# Altium schematic sheet DVM1.SchDoc
size A4; SheetNumber: 1; SheetTotal: 1
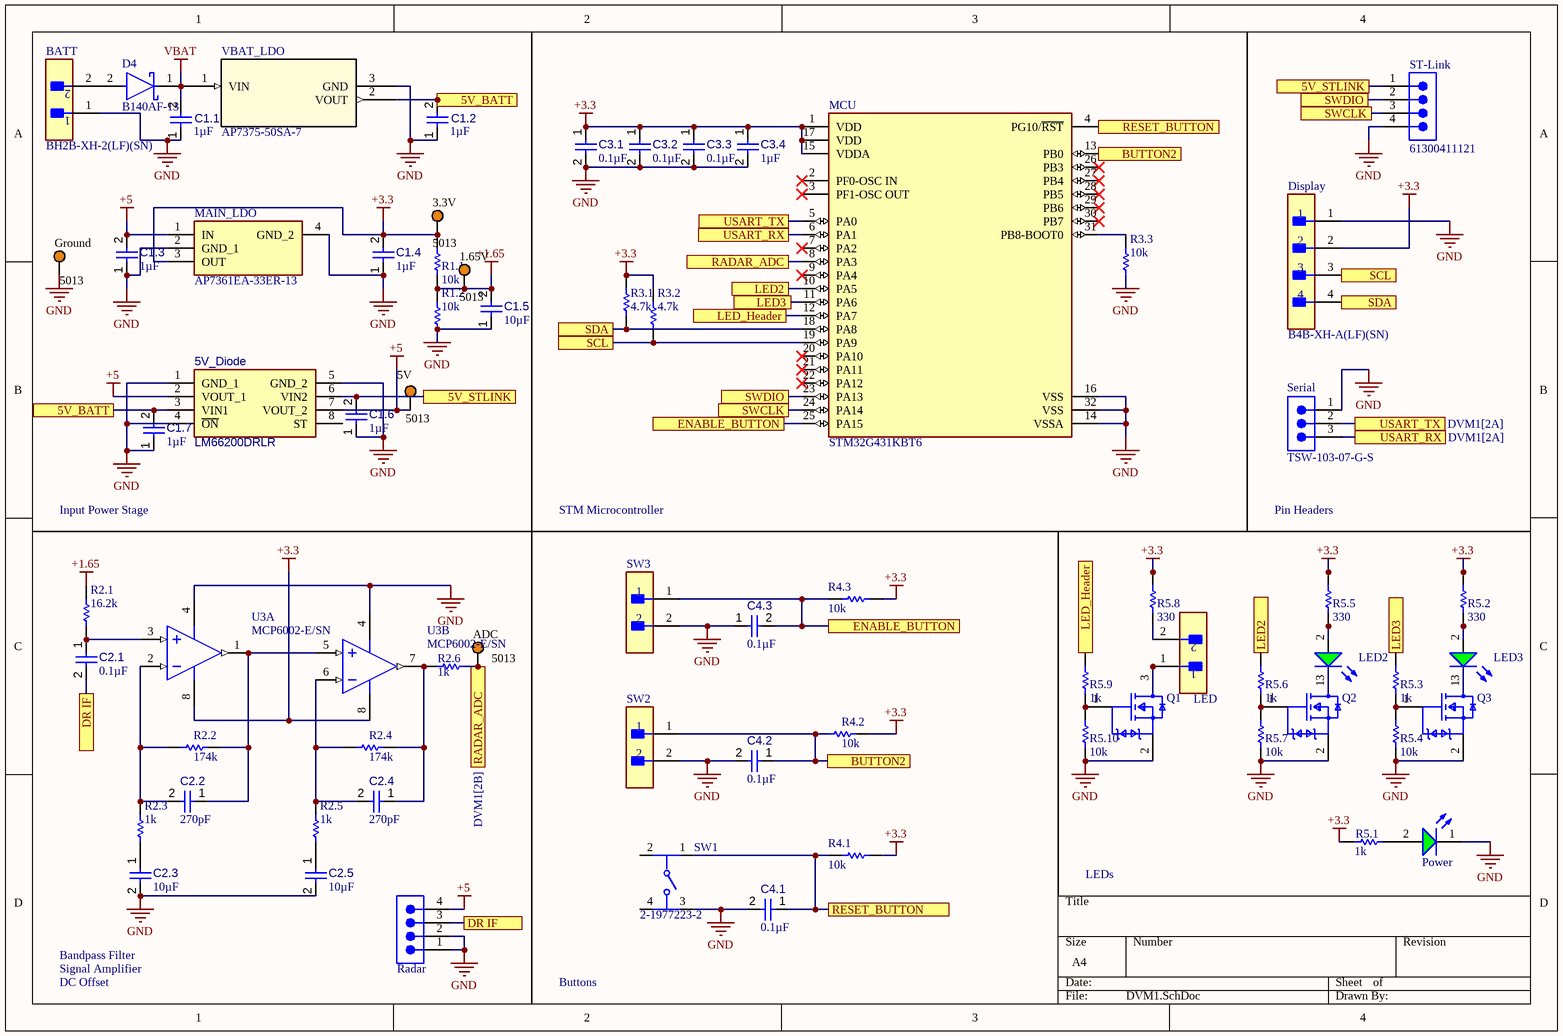
[diagram p0: DVM1.SchDoc]

## Parts
1.65V  5013  [KSTN-5013_V]
3.3V  5013  [KSTN-5013_V]
5V  5013  [KSTN-5013_V]
5V_Diode  LM66200DRLR  [LM66200DRLR-Footprint-1]
ADC  5013  [KSTN-5013_V]
BATT  BH2B-XH-2(LF)(SN)  [FP-BH2B-XH-2_LF_SN-MFG]
C1.1  value 1µF  [CAPC2013X145X50ML20T25]  (hidden comment: CAP-NP-2)
C1.2  value 1µF  [CAPC2013X145X50ML20T25]  (hidden comment: CAP-NP-2)
C1.3  value 1µF  [CAPC2013X145X50ML20T25]  (hidden comment: CAP-NP-2)
C1.4  value 1µF  [CAPC2013X145X50ML20T25]  (hidden comment: CAP-NP-2)
C1.5  value 10µF  [CAPC2013X145X50ML20T25]  (hidden comment: CAP-NP-2)
C1.6  value 1µF  [CAPC2013X145X50ML20T25]  (hidden comment: CAP-NP-2)
C1.7  value 1µF  [CAPC2013X145X50ML20T25]  (hidden comment: CAP-NP-2)
C2.1  value 0.1µF  [CAPC2013X145X50ML20T25]  (hidden comment: CAP-NP-2)
C2.2  value 270pF  [CAPC2013X145X50ML20T25]  (hidden comment: CAP-NP-2)
C2.3  value 10µF  [CAPC2013X145X50ML20T25]  (hidden comment: CAP-NP-2)
C2.4  value 270pF  [CAPC2013X145X50ML20T25]  (hidden comment: CAP-NP-2)
C2.5  value 10µF  [CAPC2013X145X50ML20T25]  (hidden comment: CAP-NP-2)
C3.1  value 0.1µF  [CAPC2013X145X50ML20T25]  (hidden comment: CAP-NP-2)
C3.2  value 0.1µF  [CAPC2013X145X50ML20T25]  (hidden comment: CAP-NP-2)
C3.3  value 0.1µF  [CAPC2013X145X50ML20T25]  (hidden comment: CAP-NP-2)
C3.4  value 1µF  [CAPC2013X145X50ML20T25]  (hidden comment: CAP-NP-2)
C4.1  value 0.1µF  [CAPC2013X145X50ML20T25]  (hidden comment: CAP-NP-2)
C4.2  value 0.1µF  [CAPC2013X145X50ML20T25]  (hidden comment: CAP-NP-2)
C4.3  value 0.1µF  [CAPC2013X145X50ML20T25]  (hidden comment: CAP-NP-2)
D4  B140AF-13  [FP-SMAF-MFG]
Display  B4B-XH-A(LF)(SN)  [FP-B4B-XH-A_LF_SN-MFG]
Ground  5013  [KSTN-5013_V]
LED  TSW-102-14-G-S  [FP-TSW-102-14-G-S-MFG]  (value not drawn)
LED2  150060VS75000  [WL-SMCW_0603_150060xx75000]  (value not drawn)
LED3  150060VS75000  [WL-SMCW_0603_150060xx75000]  (value not drawn)
MAIN_LDO  AP7361EA-33ER-13  [AP7361EA-33ER-13-Footprint-1]
MCU  STM32G431KBT6  [FP-LQFP32-5V-IPC_B]
Power  150060VS75000  [WL-SMCW_0603_150060xx75000]  (value not drawn)
Q1  DMN3023L-7  [FP-SOT23-MFG]  (value not drawn)
Q2  DMN3023L-7  [FP-SOT23-MFG]  (value not drawn)
Q3  DMN3023L-7  [FP-SOT23-MFG]  (value not drawn)
R1.1  value 10k  [RESC2013X70X40ML20T20]  (hidden comment: RES-2)
R1.2  value 10k  [RESC2013X70X40ML20T20]  (hidden comment: RES-2)
R2.1  value 16.2k  [RESC2013X70X40ML20T20]  (hidden comment: RES-2)
R2.2  value 174k  [RESC2013X70X40ML20T20]  (hidden comment: RES-2)
R2.3  value 1k  [RESC2013X70X40ML20T20]  (hidden comment: RES-2)
R2.4  value 174k  [RESC2013X70X40ML20T20]  (hidden comment: RES-2)
R2.5  value 1k  [RESC2013X70X40ML20T20]  (hidden comment: RES-2)
R2.6  value 1k  [RESC2013X70X40ML20T20]  (hidden comment: RES-2)
R3.1  value 4.7k  [RESC2013X70X40ML20T20]  (hidden comment: RES-2)
R3.2  value 4.7k  [RESC2013X70X40ML20T20]  (hidden comment: RES-2)
R3.3  value 10k  [RESC2013X70X40ML20T20]  (hidden comment: RES-2)
R4.1  value 10k  [RESC2013X70X40ML20T20]  (hidden comment: RES-2)
R4.2  value 10k  [RESC2013X70X40ML20T20]  (hidden comment: RES-2)
R4.3  value 10k  [RESC2013X70X40ML20T20]  (hidden comment: RES-2)
R5.1  value 1k  [RESC2013X70X40ML20T20]  (hidden comment: RES-2)
R5.2  value 330  [RESC2013X70X40ML20T20]  (hidden comment: RES-2)
R5.3  value 1k  [RESC2013X70X40ML20T20]  (hidden comment: RES-2)
R5.4  value 10k  [RESC2013X70X40ML20T20]  (hidden comment: RES-2)
R5.5  value 330  [RESC2013X70X40ML20T20]  (hidden comment: RES-2)
R5.6  value 1k  [RESC2013X70X40ML20T20]  (hidden comment: RES-2)
R5.7  value 10k  [RESC2013X70X40ML20T20]  (hidden comment: RES-2)
R5.8  value 330  [RESC2013X70X40ML20T20]  (hidden comment: RES-2)
R5.9  value 1k  [RESC2013X70X40ML20T20]  (hidden comment: RES-2)
R5.10  value 10k  [RESC2013X70X40ML20T20]  (hidden comment: RES-2)
Radar  61300411121  [61300411121]  (value not drawn)
Serial  TSW-103-07-G-S  [SMTC-TSW-103-07-X-S]
ST-Link  61300411121  [61300411121]
SW1  2-1977223-2  [FP-2-1977223-2-MFG]
SW2  TSW-102-14-G-S  [FP-TSW-102-14-G-S-MFG]  (value not drawn)
SW3  TSW-102-14-G-S  [FP-TSW-102-14-G-S-MFG]  (value not drawn)
U3  MCP6002-E/SN  [SOIC-SN8_L]  (parts A,B of 2)
VBAT_LDO  AP7375-50SA-7  [SOT23_DIO]

## Ports
5V_BATT (see DVM1[1B]), 5V_BATT (see DVM1[2A]), 5V_STLINK (see DVM1[2B]), 5V_STLINK (see DVM1[4A]), BUTTON2 (see DVM1[3A]), BUTTON2 (see DVM1[3C]), DR IF (see DVM1[1C]), DR IF (see DVM1[2D]), ENABLE_BUTTON (see DVM1[2B]), ENABLE_BUTTON (see DVM1[3C]), LED2 (see DVM1[2B]), LED2 (see DVM1[4C]), LED3 (see DVM1[2B]), LED3 (see DVM1[4C]), LED_Header (see DVM1[2B]), LED_Header (see DVM1[3C]), RADAR_ADC (see DVM1[2B]), RADAR_ADC (see DVM1[2C]), RESET_BUTTON (see DVM1[3A]), RESET_BUTTON (see DVM1[3D]), SCL (see DVM1[2B]), SCL (see DVM1[4B]), SDA (see DVM1[2B]), SDA (see DVM1[4B]), SWCLK (see DVM1[2B]), SWCLK (see DVM1[4A]), SWDIO (see DVM1[2B]), SWDIO (see DVM1[4A]), USART_RX (see DVM1[2A]), USART_RX (see DVM1[4B]), USART_TX (see DVM1[2A]), USART_TX (see DVM1[4B])

## Nets
+1.65: 1.65V.1 C1.5.2 R1.1.2 R1.2.2 R2.1.2
+3.3: 3.3V.1 C1.4.2 C3.1.1 C3.2.1 C3.3.1 C3.4.1 Display.2 MAIN_LDO.3(OUT) MCU.1(VDD) MCU.15(VDDA) MCU.17(VDD) R1.1.1 R3.1.1 R3.2.2 R4.1.1 R4.2.2 R4.3.1 R5.1.1 R5.2.1 R5.5.1 R5.8.1 U3.8(VDD)
+5: 5V.1 5V_Diode.2(VOUT_1) 5V_Diode.7(VOUT_2) C1.3.2 MAIN_LDO.1(IN) Radar.4
GND: 5V_Diode.1(GND_1) 5V_Diode.4(~{ON}) 5V_Diode.5(GND_2) BATT.1 C1.1.1 C1.2.1 C1.3.1 C1.4.1 C1.5.1 C1.6.1 C1.7.1 C2.3.2 C2.5.2 C3.1.2 C3.2.2 C3.3.2 C3.4.2 C4.1.2 C4.2.2 C4.3.1 Display.1 Ground.1 MAIN_LDO.2(GND_1) MAIN_LDO.4(GND_2) MCU.14(VSSA) MCU.16(VSS) MCU.32(VSS) Power.1(K) Q1.2(S) Q2.2(S) Q3.2(S) R1.2.1 R3.3.1 R5.4.2 R5.7.2 R5.10.2 Radar.1 Radar.2 Serial.1 ST-Link.4 SW1.3 SW2.2 SW3.2 U3.4(VSS) VBAT_LDO.3(GND)
VBAT: C1.1.2 D4.1(C) VBAT_LDO.1(VIN)
5V_BATT: 5V_Diode.3(VIN1) C1.2.2 C1.7.2 VBAT_LDO.2(VOUT) ; port 5V_BATT
5V_STLINK: 5V_Diode.6(VIN2) C1.6.2 ST-Link.1 ; port 5V_STLINK
BUTTON2: C4.2.1 MCU.13(PB0) R4.2.1 SW2.1 ; port BUTTON2
DR IF: C2.1.2 Radar.3 ; port DR IF
ENABLE_BUTTON: C4.3.2 MCU.25(PA15) R4.3.2 SW3.1 ; port ENABLE_BUTTON
LED2: MCU.10(PA5) R5.6.1 ; port LED2
LED3: MCU.11(PA6) R5.3.1 ; port LED3
LED_Header: MCU.12(PA7) R5.9.1 ; port LED_Header
RADAR_ADC: ADC.1 MCU.8(PA3) R2.6.1 ; port RADAR_ADC
RESET_BUTTON: C4.1.1 MCU.4(PG10/~{RST}) R4.1.2 SW1.1 ; port RESET_BUTTON
SCL: Display.3 MCU.19(PA9) R3.2.1 ; port SCL
SDA: Display.4 MCU.18(PA8) R3.1.2 ; port SDA
SWCLK: MCU.24(PA14) ST-Link.3 ; port SWCLK
SWDIO: MCU.23(PA13) ST-Link.2 ; port SWDIO
USART_RX: MCU.6(PA1) Serial.3 ; port USART_RX
USART_TX: MCU.5(PA0) Serial.2 ; port USART_TX
NetBATT_2: BATT.2 D4.2(A)
NetC2.1_1: C2.1.1 R2.1.1 U3.3(VINA+)
NetC2.2_1: C2.2.1 R2.2.2 U3.1(VOUTA) U3.5(VINB+)
NetC2.2_2: C2.2.2 R2.2.1 R2.3.2 U3.2(VINA-)
NetC2.3_1: C2.3.1 R2.3.1
NetC2.4_1: C2.4.1 R2.4.2 R2.6.2 U3.7(VOUTB)
NetC2.4_2: C2.4.2 R2.4.1 R2.5.2 U3.6(VINB-)
NetC2.5_1: C2.5.1 R2.5.1
NetLED2_1: LED2.1(K) Q2.3(D)
NetLED2_2: LED2.2(A) R5.5.2
NetLED3_1: LED3.1(K) Q3.3(D)
NetLED3_2: LED3.2(A) R5.2.2
NetLED_1: LED.1 Q1.3(D)
NetLED_2: LED.2 R5.8.2
NetMCU_31: MCU.31(PB8-BOOT0) R3.3.2
NetPower_2: Power.2(A) R5.1.2
NetQ1_1: Q1.1(G) R5.9.2 R5.10.1
NetQ2_1: Q2.1(G) R5.6.2 R5.7.1
NetQ3_1: Q3.1(G) R5.3.2 R5.4.1

Not connected (* = marked no-connect by the designer): 5V_Diode 8(ST); MCU 2(PF0-OSC_IN)* 3(PF1-OSC_OUT)* 7(PA2)* 9(PA4)* 20(PA10)* 21(PA11)* 22(PA12)* 26(PB3)* 27(PB4)* 28(PB5)* 29(PB6)* 30(PB7)*; SW1 2 4

## Notes on the sheet
- Input Power Stage
- STM Microcontroller
- Pin Headers
- LEDs
- Bandpass Filter
- Signal Amplifier
- DC Offset
- Buttons

## Library data of the parts
1.65V 3.3V 5V ADC Ground = CMP-1672-00005-4: Test Point, Orange, Through Hole, RoHS, Bulk; Manufacturer: Keystone; REACH SVHC: No SVHC; ComponentLink2Description: Datasheet; PackageDescription: 1-Pin Through Hole Device, Dia 3.17 mm; Package Quantity: 100; PackageReference: 5013; Contact Material: Bronze; DatasheetVersion: Rev. F, 12/2013; ComponentLink2URL: http://www.keyelco.com/product-pdf.cfm?p=1322; Contact Plating: Silver; ComponentLink1URL: http://www.keyelco.com/; Packaging: Bulk; ComponentLink1Description: Manufacturer URL; Colour: Orange; Height: 8.12 mm; RoHSCompliant: True; Mount: Through Hole; Mounting Technology: Through Hole
5V_Diode = CMP-004-00031-1: 1.6-V to 5.5-V, 40-mΩ, 2.5-A, low-IQ, dual ideal diode 8-SOT-5X3 -40 to 125; Pins: 8
BATT = CMP-17439-000730-1: CONN HEADER VERT 2POS 2.5MM; Voltage Rating (AC): 250V; Number of Positions: 2; Pitch: 2.5mm; Contact Type: Male Pin; Max Operating Temperature: 85°C; Termination: Press-Fit; Connector Type: Header; Flammability Rating: UL94 V-0; Min Operating Temperature: -25°C; Contact Material: Copper Alloy; Series: XH; Lead Free: Lead Free; Fastening Type: Detent; Contact Finish - Mating: TIN; Number of Rows: 1; Insulation Color: Natural; Insulation Material: Nylon; Mount: Through Hole; Contact Shape: Square
C1.1-C1.7 C2.1-C2.5 C3.1-C3.4 C4.1-C4.3 = CMP-001-00010-6: Chip Capacitor, 1 uF, +/-10%, 25 V, 0805 (2012 Metric); Capacitor Type: Ceramic; Tolerance: 10%; Voltage Rating: 25V; Case/Package: 0805; Max Operating Temperature: 125°C; Min Operating Temperature: -55°C; Mounting Technology: SM; Pins: 2; RoHS Compliant: True
D4 = CMP-12790-000095-1: DIODE SCHOTTKY 40V 1A SMAF; Packaging: Tape and Reel; RoHS Compliant: Yes; Max Reverse Voltage (DC): 40V; Average Rectified Current: 1A; Mount: Surface Mount
Display = CMP-17439-000250-1: CONN HEADER VERT 4POS 2.5MM; Number of Contacts: 4; Contact Resistance: 20mR; Voltage Rating: 250V; Max Current Rating: 3A; Gender: Male; Wire/Cable Gauge: 22AWG; Mated Stacking Heights: 9.8mm; Insulation Resistance: 1GR; Orientation: Straight; Contact Type: Male Pin; Contact Finish - Mating: TIN; Series: XH; Max Voltage Rating (AC): 250V; Lead Pitch: 2.5mm; Contact Shape: Square; Insulation Color: Natural; Termination: Solder; Lead Free: Lead Free; Voltage Rating (AC): 250V; Number of Rows: 1; Flammability Rating: UL94 V-0; Number of Positions: 4; Max Operating Temperature: 85°C; Package Quantity: 500; Mount: Through Hole; REACH SVHC: No SVHC; Connector Type: Header; Insulation Material: Nylon; Fastening Type: Detent; Min Operating Temperature: -25°C; Housing Color: White; Packaging: Bulk; Contact Plating: Tin; Contact Material: Brass; Max Voltage Rating (DC): 250V; Housing Material: Polyamide; Color: Natural; Material: Polyamide; Pitch: 2.5mm; Depth: 5.75mm; Current Rating: 3A; Length: 12.4mm
LED SW2 SW3 = CMP-02766-001740-1: CONN HEADER VERT 2POS 2.54MM; Number of Positions: 2; Max Current Rating: 7.6A; Gender: Male; Max Voltage Rating (AC): 550V; Contact Mating Length: 0.32inch; REACH SVHC: No SVHC; Width: 2.54mm; Insulation Material: PBT; Contact Shape: Square; Contact Plating: Gold; Min Operating Temperature: -55°C; Contact Material: Bronze; Color: Black; Number of Contacts: 2; Housing Material: Polyester; Orientation: Straight; Flammability Rating: UL94 V-0; Max Operating Temperature: 125°C; Contact Type: Male Pin; Radiation Hardening: No; Termination: Solder; RoHS Compliant: Yes; Lead Free: Lead Free; Fastening Type: Pull; Pitch: 2.54mm; Number of Rows: 1; Series: TSW; Insulation Color: Black; Package Quantity: 1; Connector Type: Header; Length: 5.08mm; Contact Finish - Mating: GOLD; Mount: Through Hole; Housing Color: Black; Depth: 2.54mm; Packaging: Bulk
LED2 LED3 Power = CMP-1426-00006-7: WURTH ELEKTRONIK - 150060VS75000 - LED, Green, SMD, 0603, 30 mA, 2 V, 570 nm; Reverse Voltage: 5V; Power Dissipation: 72mW; Dominant Wavelength: 570nm; Peak Wavelength: 572nm; Forward Current: 100mA; Forward Voltage: 2V; Lens Style: Clear, Rectangular; Test Current: 20mA; Max Junction Temperature (Tj): 95°C; Viewing Angle: 140°; Luminous Intensity: 40mcd; Height: 700µm; Width: 800µm; Length: 1.6mm; Mount: Surface Mount; Min Operating Temperature: -40°C; Max Reverse Voltage (DC): 5V; Case Code (Imperial): 0603; Wavelength: 570nm; Color: Green; REACH SVHC: Unknown; RoHS: Compliant; Max Operating Temperature: 85°C; Packaging: Tape and Reel; Case/Package: 0603; Number of Pins: 2; Case Code (Metric): 1608
MAIN_LDO = CMP-019-00049-1: 1A Low Dropout Adjustable and Fixed-Mode Regulator with Enable; Max Supply Voltage: 6V; Min Operating Temperature: -40°C; Max Operating Temperature: 85°C
MCU = CMP-12105-000140-1: IC MCU 32BIT 128KB FLASH 32LQFP
Q1-Q3 = CMP-12801-000035-1: MOSFET N-CH 30V 6.2A SOT23; Manufacturer: Diodes Inc.; Automotive Grade: Grade 0; Max Junction Temp: +150°C; Number Of Channels: 1; Threshold Vgs Max: 1.8V; Depletion Mode: False; Input Capacitace At Vds: 873pF @ 15V; Turn Off Delay Time: 231ns; Pulse Drain Current: 44A; Standoff Height: 0.013mm; Gate To Source Voltage: 20V; Rthja Max: 97°C/W; Gate Charge At Vgs: 18.4nC @ 10V; Drain To Source Resistance: 25mΩ; Threshold Vgs Min: 0.8V; Turn On Delay Time: 17ns; Power Dissipation: 0.9W; Max Forward Diode Voltage: 1.2V; Category: Trans; Octopart: https://octopart.com/dmn3023l-7-diodes+inc.-65294126; Mouser Description: MOSFET N-Ch Enh Mode FET 30Vdss 20Vgss 51A; Digikey Description: MOSFET N-CH 30V 6.2A SOT23; Package: SOT23; Automotive: Yes; Number Of N Channels: 1; Height: 1.1mm; Device Class L3: MOSFETs; Device Class L1: Discrete Semiconductors; Footprint Url: https://www.diodes.com/assets/Package-Files/SOT23.pdf; Drain To Source Voltage: 30V; Device Class L2: Transistors; ComponentLink2Description: Datasheet; RoHS: TRUE; Continuous Drain Current: 6.2A; Lead Free: Yes; Temperature Range High: +150°C; Temperature: -55°C to +150°C; Manufacturer Part Number: DMN3023L-7; Drain To Source Breakdown Voltage: 30V; ComponentLink2URL: https://www.diodes.com/assets/Datasheets/DMN3023L.pdf; Temperature Range Low: -55°C
R1.1 R1.2 R2.1-R2.6 R3.1-R3.3 R4.1-R4.3 R5.1-R5.10 = CMP-009-00010-5: Chip Resistor, 1 KOhm, +/- 1%, 0.125 W, -55 to 155 degC, 0805 (2013 Metric); Power: 125mW; Voltage Rating: 150V; Case/Package: 0805; Max Operating Temperature: 155°C; Min Operating Temperature: -55°C; Mounting Technology: SM; Pins: 2; RoHS Compliant: True; Tolerance: 1%
Radar ST-Link = CMP-1502-01064-4: THT Vertical Pin Header WR-PHD, Pitch 2.54 mm, Single Row, 4 pins; Connector Type: Male Pin; Gender: Male; Current Rating: 3A; Number of Positions: 4; Operating Supply Voltage: 250V; Contact Resistance: 20mΩ; Pitch: 2.54mm; Max Operating Temperature: 105°C; Mount: Through Hole; Contact Material: Gold; Contact Plating: Gold; Number of Contacts: 4; Orientation: Vertical; Packaging: Bulk; Contact Mating Length: 5.9944mm; Voltage Rating: 250V; Number of Rows: 1; Height: 8.89mm; Lead Free: Lead Free; Lead Pitch: 2.54mm; Number of Pins: 4; Color: Black; Min Operating Temperature: -40°C; RoHS: Compliant; Termination: Solder
Serial = CMP-1024-00333-1: 0.025" SQ Post Header, Through-hole, Vertical, -55 to 125 degC, 2.54 mm Pitch, 3-Pin, Male, RoHS; Manufacturer: Samtec; Pitch: 2.54 mm; ComponentLink3URL: http://www.samtec.com/documents/webfiles/cpdf/TSW-XXX-XX-XXX-X-XX-XXX-MKT.pdf; Temperature Range: -55 to 125 degC; DatasheetVersion: F-214; ComponentLink1Description: Manufacturer URL; ComponentLink2URL: http://www.samtec.com/documents/webfiles/pdf/TSW_TH.PDF; RoHS: True; Orientation: Vertical; ComponentLink2Description: Datasheet; ComponentLink3Description: Package Specification; PackageDescription: .025[0.64] SQ. Post Terminal Strip Assembly; Mounting Technology: Through-hole; PackageVersion: DM, 8/1988; ComponentLink1URL: http://www.samtec.com; PackageReference: TSW-103-07-X-S; PartNumber: TSW-103-07-G-S
SW1 = CMP-03407-000026-1: SWITCH TACTILE SPST-NO 0.05A 24V; RoHS Compliant: Yes
U3 = CMP-0187-00368-3: None; Input Offset Voltage (Vos): 4.5mV; Slew Rate: 0.6V/µs; Bandwidth: 1MHz; Operating Supply Voltage: 5.5V; Nominal Supply Current: 100uA; Number of Channels: 2; Input Bias Current: 1pA; Amplifier Type: GENERAL PURPOSE; Voltage Gain: 112dB; Power Supply Rejection Ratio (PSRR): 86dB; Max Supply Voltage: 6V; Common Mode Rejection Ratio: 60dB; Min Supply Voltage: 1.8V; Output Current: 23mA; Min Operating Temperature: -40°C; Radiation Hardening: No; Mount: Surface Mount; Package Quantity: 100; REACH SVHC: No SVHC; Width: 3.9mm; Packaging: Rail/Tube; Slew Rate-Nom: 0.6V/µs; RoHS Compliant: Yes; Technology: CMOS; Lead Free: Lead Free; Number of Pins: 8; Max Operating Temperature: 125°C; Gain Bandwidth Product: 1MHz; Number of Amplifiers: 2; Supply Current: 100uA; Number of Elements: 2; Input Offset Voltage-Max: 4.5mV; Unity Gain Bandwidth Product: 1MHz; Length: 4.9mm; Case/Package: SOIC; Number of Circuits: 2; Height: 1.25mm
VBAT_LDO = AP7375-50SA-7: No Description Available; Manufacturer_Name: Diodes Inc; Copyright: Copyright (C) 2026 Ultra Librarian. All rights reserved.; Manufacturer_Part_Number: AP7375-50SA-7; Digi-Key_Part_Number_1: 31-AP7375-50SA-7TR-ND; Digi-Key_Part_Number_2: 31-AP7375-50SA-7CT-ND; Digi-Key_Part_Number_3: 31-AP7375-50SA-7DKR-ND; RefDes: RefDes; Type: Type